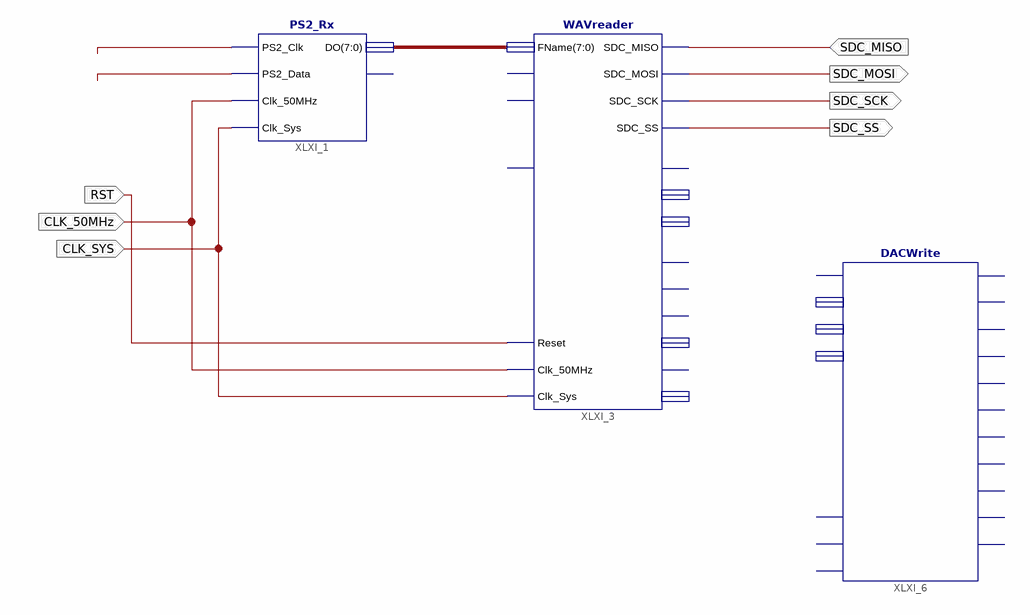
[diagram p0: schematic sheet 1]
// Xilinx ISE schematic Project_Schema.sch (spartan3e) as structural Verilog: 3 symbols, 7 ports
module Project_Schema (
  input  CLK_SYS,
  input  CLK_50MHz,
  input  RST,
  input  SDC_MISO,
  output SDC_MOSI,
  output SDC_SCK,
  output SDC_SS
);

  wire XLXN_51, XLXN_52;
  wire [7:0] XLXN_35;

  WAVreader XLXI_3 (
    .FName(XLXN_35), .SDC_MOSI(SDC_MOSI), .SDC_SCK(SDC_SCK), .SDC_SS(SDC_SS), .SDC_MISO(SDC_MISO),
    .Reset(RST), .Clk_50MHz(CLK_50MHz), .Clk_Sys(CLK_SYS));  // open: Start, Abort, DO_Pop, FmtMnS, Fmt8n16, FmtSRate, SRate_Tick, Error, DO_Rdy, DO_L, DO_R, Busy
  PS2_Rx XLXI_1 (
    .PS2_Clk(XLXN_51), .PS2_Data(XLXN_52), .Clk_50MHz(CLK_50MHz), .Clk_Sys(CLK_SYS), .DO(XLXN_35));  // open: DO_Rdy
  DACWrite XLXI_6 ();  // open: Reset, Start, SPI_MISO, Cmd, Addr, DATA, DAC_CLR, DAC_CS, SPI_MOSI, SPI_SCK, SPI_SS_B, AMP_CS, AD_CONV, SF_CE0, FPGA_INIT_B, Busy, Clk_50MHz, Clk_Sys
endmodule
